# Altium schematic sheet 简化版原理图.SchDoc
size A3
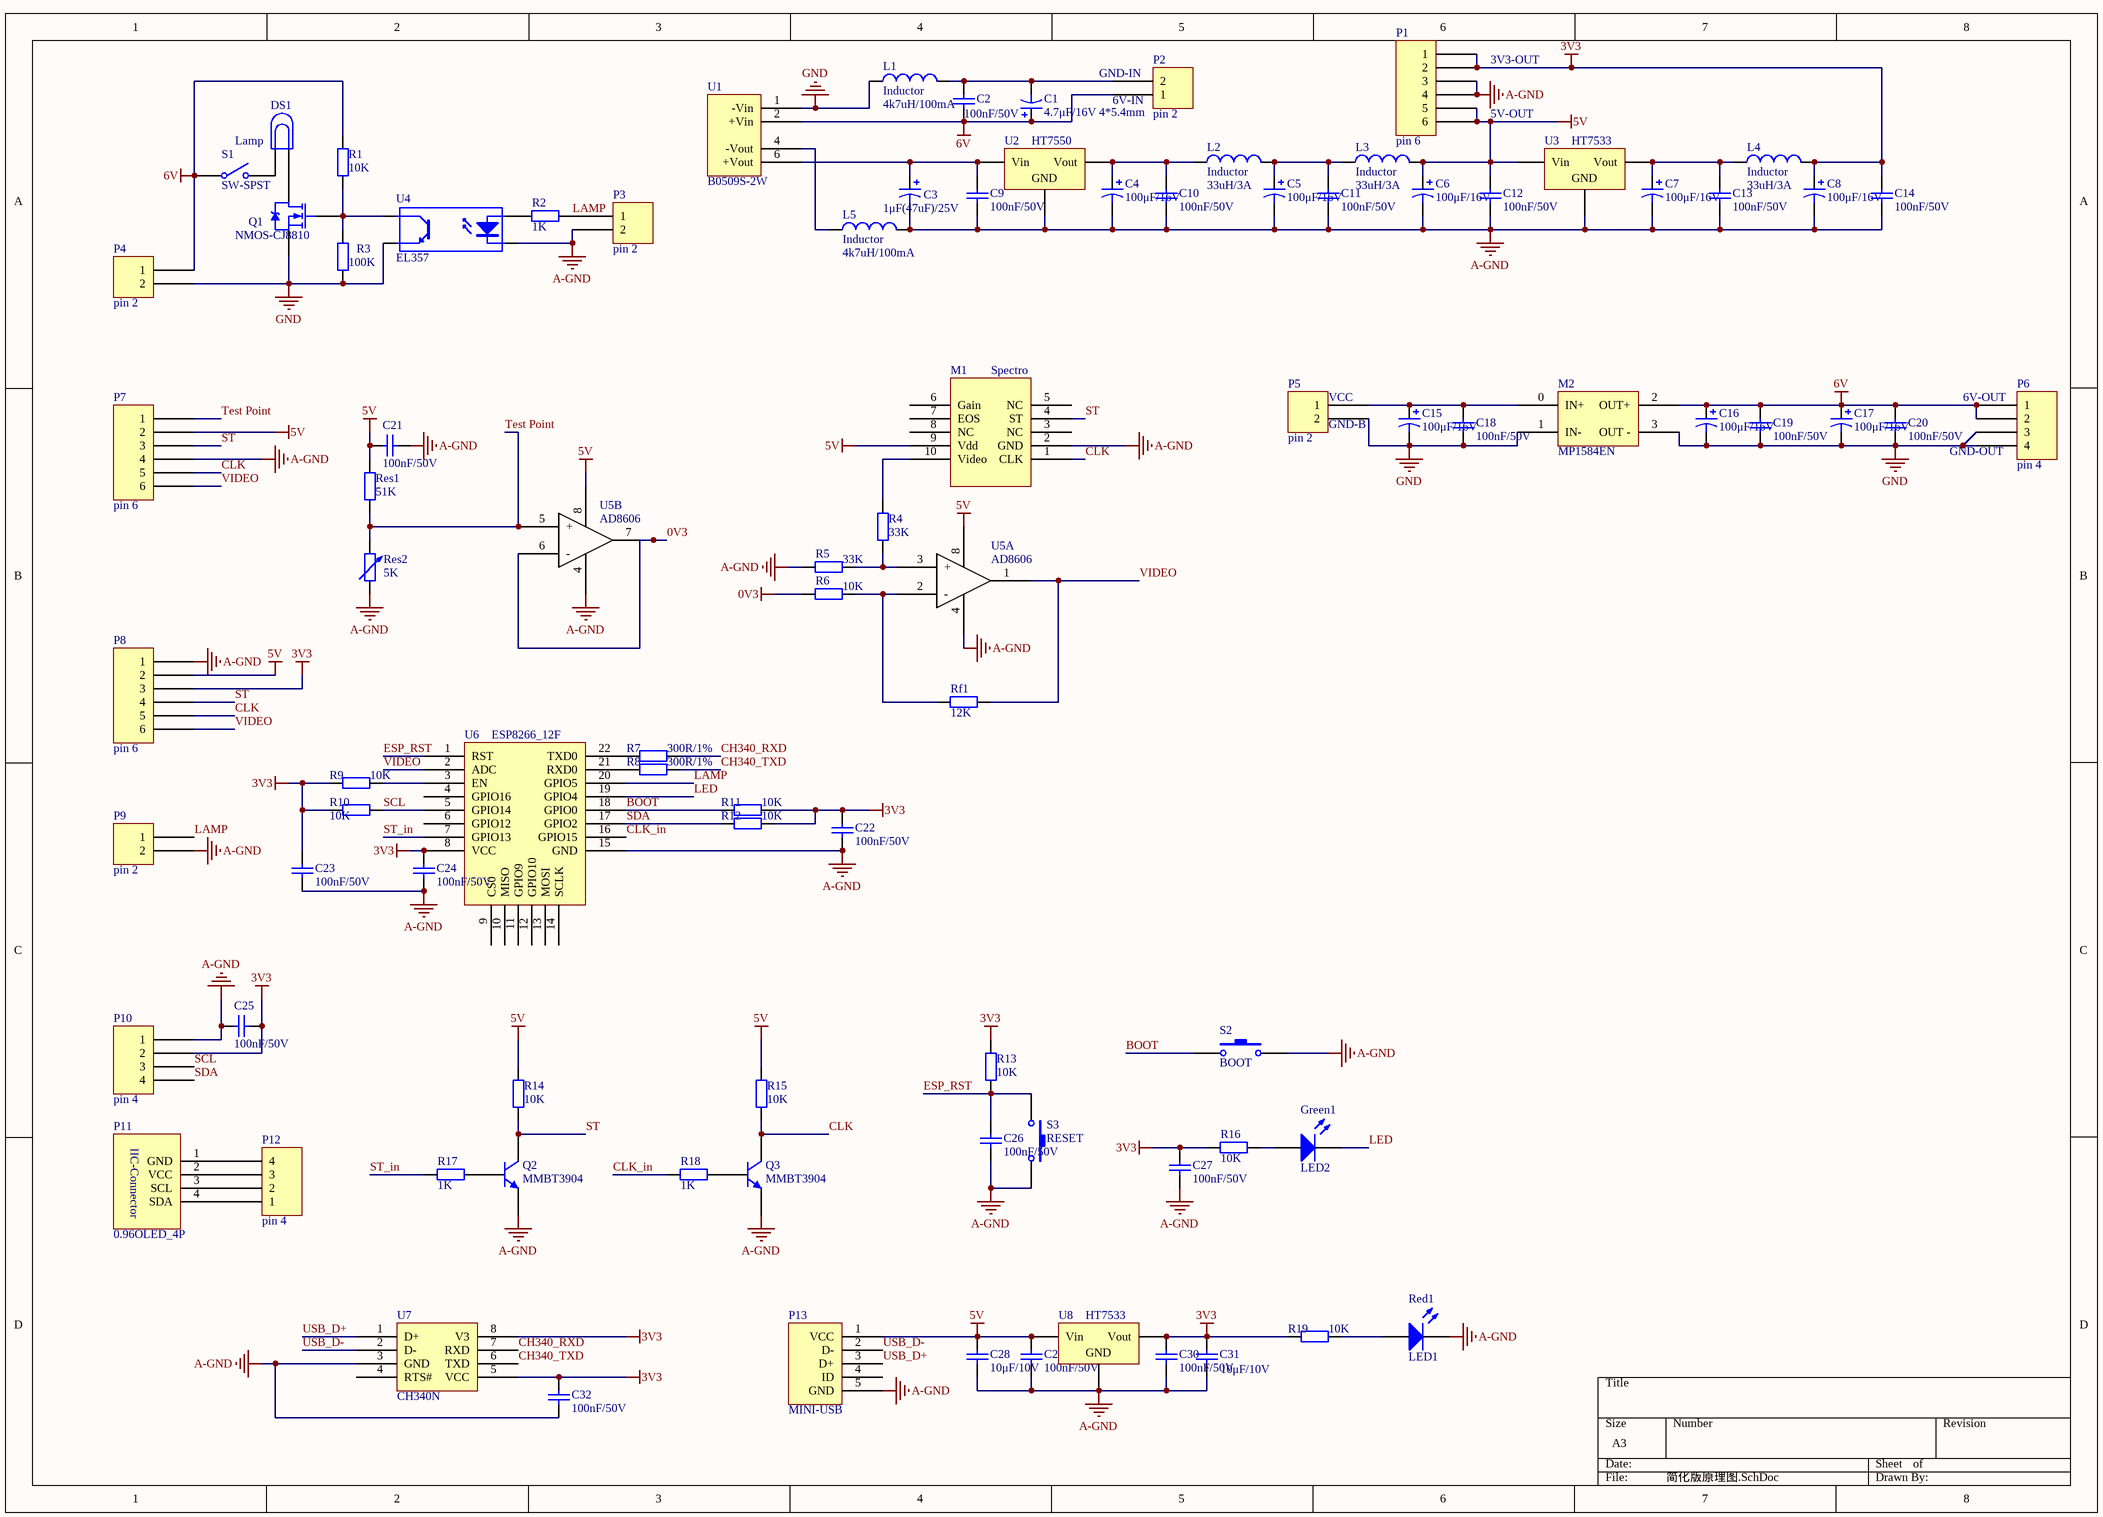
[diagram p0: 简化版原理图.SchDoc]

## Parts
C1  4.7μF/16V 4*5.4mm  [CAP4x5.4-SMD]
C2  100nF/50V  [0603]
C3  1μF(47uF)/25V  [CAP6.3x5.4-SMD]
C4  100μF/16V  [CAP6.3x5.4-SMD]
C5  100μF/16V  [CAP6.3x5.4-SMD]
C6  100μF/16V  [CAP6.3x5.4-SMD]
C7  100μF/16V  [CAP6.3x5.4-SMD]
C8  100μF/16V  [CAP6.3x5.4-SMD]
C9  100nF/50V  [0603]
C10  100nF/50V  [0603]
C11  100nF/50V  [0603]
C12  100nF/50V  [0603]
C13  100nF/50V  [0603]
C14  100nF/50V  [0603]
C15  100μF/16V  [CAP6.3x5.4-SMD]
C16  100μF/16V  [CAP6.3x5.4-SMD]
C17  100μF/16V  [CAP6.3x5.4-SMD]
C18  100nF/50V  [0603]
C19  100nF/50V  [0603]
C20  100nF/50V  [0603]
C21  100nF/50V  [0603]
C22  100nF/50V  [0603]
C23  100nF/50V  [0603]
C24  100nF/50V  [0603]
C25  100nF/50V  [0603]
C26  100nF/50V  [0603]
C27  100nF/50V  [0603]
C28  10μF/10V  [0805]
C29  100nF/50V  [0603]
C30  100nF/50V  [0603]
C31  10μF/10V  [0805]
C32  100nF/50V  [0603]
DS1  Lamp  [LAMP]
Green1  LED2  [0805-LED]
L1  Inductor  value 4k7uH/100mA  [L 0810]
L2  Inductor  value 33uH/3A  [0650]
L3  Inductor  value 33uH/3A  [0650]
L4  Inductor  value 33uH/3A  [0650]
L5  Inductor  value 4k7uH/100mA  [L 0810]
M1  Spectro  [c10988ma]
M2  MP1584EN  [MP1584EN模块]
P1  pin 6  [PIN-6-2.54-1.0]
P2  pin 2  [PIN-2-2.54-1.0]
P3  pin 2  [PIN-2-2.54-1.0]
P4  pin 2  [PIN-2-2.54-1.0]
P5  pin 2  [PIN-2-2.54-1.0]
P6  pin 4  [PIN-4-2.54-1.0]
P7  pin 6  [PIN-6-2.54-1.0]
P8  pin 6  [PIN-6-2.54-1.0]
P9  pin 2  [PIN-2-2.54-1.0]
P10  pin 4  [PIN-4-2.54-1.0]
P11  0.96OLED_4P  [OLED0.96-4P]
P12  pin 4  [PIN-4-2.54-1.0]
P13  MINI-USB  [Micro_USB全贴片]
Q1  NMOS-CJ8810  [SOT-23]
Q2  MMBT3904  [SOT-23]
Q3  MMBT3904  [SOT-23]
R1  10K  [0603]
R2  1K  [0603]
R3  100K  [0603]
R4  33K  [0603]
R5  33K  [0603]
R6  10K  [0603]
R7  300R/1%  [0603]
R8  300R/1%  [0603]
R9  10K  [0603]
R10  10K  [0603]
R11  10K  [0603]
R12  10K  [0603]
R13  10K  [0603]
R14  10K  [0603]
R15  10K  [0603]
R16  10K  [0603]
R17  1K  [0603]
R18  1K  [0603]
R19  10K  [0603]
Red1  LED1  [0805-LED]
Res1  51K  [0603]
Res2  5K  [RES-ADJ]
Rf1  12K  [0603]
S1  SW-SPST  [swich-big]
S2  BOOT  [Swich-mini]
S3  RESET  [Swich-mini]
U1  B0509S-2W  [B0509S-2W]
U2  HT7550  [SOT-89]
U3  HT7533  [SOT-89]
U4  EL357  [SOP4-bigger]
U5  AD8606  [SOP8]  (parts A,B of 2)
U6  ESP8266_12F  [esp8266-12f]
U7  CH340N  [SOP8]
U8  HT7533  [SOT-89]

## Nets
0V3: R6.1 U5.6(-) U5.7(OUT)
3V3: C8.1 C14.2 C22.2 C23.2 C24.2 C25.1 C27.2 C30.2 C31.1 C32.2 L4.2 P1.1 P1.2 P8.3 P10.2 R9.1 R10.1 R11.2 R12.2 R13.2 R16.2 R19.1 U6.8(VCC) U7.5(VCC) U7.8(V3) U8.3(Vout)
5V: C6.1 C12.2 C21.2 C28.1 C29.2 L3.2 M1.9(Vdd) P1.5 P1.6 P7.2 P8.2 P13.1(VCC) R14.2 R15.2 Res1.2 U3.2(Vin) U5.8(VCC) U8.2(Vin)
6V: C1.1 C2.1 C16.1 C17.1 C19.2 C20.2 M2.2(OUT+) P2.1 P4.1 P6.1 P6.2 R1.2 S1.1(COMMON) U1.2(+Vin)
A-GND: C3.2 C4.2 C5.2 C6.2 C7.2 C8.2 C9.1 C10.1 C11.1 C12.1 C13.1 C14.1 C21.1 C22.1 C23.1 C24.1 C25.2 C26.1 C27.1 C28.2 C29.1 C30.1 C31.2 C32.1 L5.2 M1.2(GND) P1.3 P1.4 P3.2 P7.4 P8.1 P9.2 P10.1 P13.5(GND) Q2.2(E) Q3.2(E) R5.1 Red1.2(K) Res2.1 S2.2 S3.2 U2.1(GND) U3.1(GND) U4.2(K) U5.4(VEE) U6.15(GND) U7.3(GND) U8.1(GND)
GND: C15.2 C16.2 C17.2 C18.1 C19.1 C20.1 L1.1 M2.1(IN-) M2.3(OUT_-) P4.2 P5.2 P6.3 P6.4 Q1.2(S) R3.1 U1.1(-Vin) U4.3(E)
BOOT: R11.1 S2.1 U6.18(GPIO0)
CH340_RXD: R7.2 U7.7(RXD)
CH340_TXD: R8.2 U7.6(TXD)
CLK: M1.1(CLK) P7.5 P8.5 Q3.3(C) R15.1
CLK_in: R18.2 U6.16(GPIO15)
ESP_RST: C26.2 R13.1 S3.1 U6.1(RST)
LAMP: P3.1 P9.1 R2.2 U6.20(GPIO5)
LED: Green1.2(K) U6.19(GPIO4)
SCL: P10.3 R10.2 U6.5(GPIO14)
SDA: P10.4 R12.1 U6.17(GPIO2)
ST: M1.4(ST) P7.3 P8.4 Q2.3(C) R14.1
ST_in: R17.2 U6.7(GPIO13)
Test Point: P7.1 Res1.1 Res2.2 U5.5(+)
USB_D+: P13.3(D+) U7.1(D+)
USB_D-: P13.2(D-) U7.2(D-)
VIDEO: P7.6 P8.6 Rf1.2 U5.1(OUT) U6.2(ADC)
NetC1_2: C1.2 C2.2 L1.2 P2.2
NetC3_1: C3.1 C9.2 U1.6(+Vout) U2.2(Vin)
NetC4_1: C4.1 C10.2 L2.1 U2.3(Vout)
NetC5_1: C5.1 C11.2 L2.2 L3.1
NetC7_1: C7.1 C13.2 L4.1 U3.3(Vout)
NetC15_1: C15.1 C18.2 M2.0(IN+) P5.1
NetDS1_1: DS1.1 S1.2(NO)
NetDS1_2: DS1.2 Q1.3(D)
NetGreen1_1: Green1.1(A) R16.1
NetL5_1: L5.1 U1.4(-Vout)
NetM1_10: M1.10(Video) R4.2
NetP11_1: P11.1(GND) P12.4
NetP11_2: P11.2(VCC) P12.3
NetP11_3: P11.3(SCL) P12.2
NetP11_4: P11.4(SDA) P12.1
NetQ1_1: Q1.1(G) R1.1 R3.2 U4.4(C)
NetQ2_1: Q2.1(B) R17.1
NetQ3_1: Q3.1(B) R18.1
NetR2_1: R2.1 U4.1(A)
NetR4_1: R4.1 R5.2 U5.3(+)
NetR6_2: R6.2 Rf1.1 U5.2(-)
NetR7_1: R7.1 U6.22(TXD0)
NetR8_1: R8.1 U6.21(RXD0)
NetR9_2: R9.2 U6.3(EN)
NetR19_2: R19.2 Red1.1(A)

Not connected (* = marked no-connect by the designer): M1 3(NC) 5(NC) 6(Gain) 7(EOS) 8(NC); P13 4(ID); U6 4(GPIO16) 6(GPIO12) 9(CS0) 10(MISO) 11(GPIO9) 12(GPIO10) 13(MOSI) 14(SCLK); U7 4(RTS#)

## Notes on the sheet
- (near P2) GND-IN
- (near P2) 6V-IN
- 3V3-OUT
- 5V-OUT
- (near P5) VCC
- (near P5) GND-B
- (near P6) GND-OUT
- (near P6) 6V-OUT
- (in symbol 0.96OLED_4P) IIC-Connector

## Library data of the parts
C1 C3-C8 C15-C17 = Cap Pol1: Polarized Capacitor (Radial); Value: 100μF; Published: 8-Jun-2000; LatestRevisionDate: 17-Jul-2002; LatestRevisionNote: Re-released for DXP Platform.; PackageReference: RB7.6-15; Publisher: Altium Limited; PackageDescription: Polarized Capacitor (Radial); 2 Leads
C2 C9-C14 C18-C32 = Cap: Capacitor; Value: 0.1μF; Published: 8-Jun-2000; LatestRevisionDate: 17-Jul-2002; LatestRevisionNote: Re-released for DXP Platform.; PackageReference: RAD-0.3; Publisher: Altium Limited; PackageDescription: Radial Cap, Thru-Hole; 2 Leads; 0.3 in Pin Spacing
DS1 = Lamp: Incandescent Bulb; Published: 24-Mar-1999; LatestRevisionNote: Re-released for DXP Platform.; PackageReference: PIN2; Publisher: Altium Limited
Green1 Red1 = LED1: Typical RED GaAs LED; Published: 8-Jun-2000; LatestRevisionDate: 08-Jul-2005; LatestRevisionNote: Mech Layer 1 removed.; PackageReference: LED-1; Publisher: Altium Limited; PackageDescription: LED; 2 Leads
L1-L5 = Inductor: Code_IEC: 1005; Published: 8-Jun-2000; LatestRevisionDate: 29-May-2009; LatestRevisionNote: IPC-7351 Footprint Added.; PackageReference: 0402-A; Publisher: Altium Limited; PackageDescription: Chip Inductor; Code_JEITA: 0402
M2 = MP1584EN模块
P13 = MINI-USB_JX
Q1 = NMOS-2: N-Channel Power MOSFET; Note: Pin 2 is electrically connected to pin 4.; Published: 8-Jun-2000; LatestRevisionDate: 17-Jul-2002; LatestRevisionNote: Re-released for DXP Platform.; DatasheetVersion: PD-9.814; PackageVersion: Feb-1997; PackageReference: TO-220AB; Publisher: Altium Limited; PackageDescription: TO, Thru-Hole, Vertical, Heatsink Mounted; 3 In-Line Leads; Pitch 2.54 mm; ComponentLink1Description: Manufacturer Link; ComponentLink1URL: http://www.irf.com/
Q2 Q3 = 2N3904: NPN General Purpose Amplifier; Published: 8-Jun-2000; LatestRevisionDate: 15-Jan-2003; LatestRevisionNote: PCB Footprint 'BCY-W3/D4.7' replaced; DatasheetVersion: 1997; PackageVersion: Sep-1998; PackageReference: TO-92A; Publisher: Altium Limited; PackageDescription: TO, Flat Index; 3 In-Line, Axial Leads; Body Dia. 4.5mm; Leads 0.51 x 0.48 mm (max); ComponentLink1Description: Manufacturer Link; ComponentLink1URL: http://www.fairchildsemi.com/; ComponentLink2Description: Datasheet; ComponentLink2URL: http://www.fairchildsemi.com/ds/2N%2F2N3904.pdf
R1 R2 = Res2: Resistor; Value: 100K; Published: 8-Jun-2000; LatestRevisionDate: 17-Jul-2002; LatestRevisionNote: Re-released for DXP Platform.; PackageReference: AXIAL-0.4; Publisher: Altium Limited; PackageDescription: Axial Device, Thru-Hole; 2 Leads; 0.4 in Pin Spacing
R3-R6 R9-R16 R19 Res1 = Res2: Resistor; Published: 8-Jun-2000; LatestRevisionDate: 17-Jul-2002; LatestRevisionNote: Re-released for DXP Platform.; PackageReference: AXIAL-0.4; Publisher: Altium Limited; PackageDescription: Axial Device, Thru-Hole; 2 Leads; 0.4 in Pin Spacing
  R3: Value: 100K
  R4 R5: Value: 33K
  R6 R9-R16 R19: Value: 10K
  Res1: Value: 51K
R7 R8 R17 R18 = Res2: Resistor; Value: 10K; Published: 8-Jun-2000; LatestRevisionDate: 17-Jul-2002; LatestRevisionNote: Re-released for DXP Platform.; PackageReference: AXIAL-0.4; Publisher: Altium Limited; PackageDescription: Axial Device, Thru-Hole; 2 Leads; 0.4 in Pin Spacing
Res2 = Res Adj2: Variable Resistor; Value: 3.3K; Set Position: 0.5; Published: 8-Jun-2000; LatestRevisionDate: 17-Jul-2002; LatestRevisionNote: Re-released for DXP Platform.; PackageReference: AXIAL-0.6; Publisher: Altium Limited; PackageDescription: Axial Device, Thru-Hole; 2 Leads; 0.6 in Pin Spacing
Rf1 = Res2: Resistor; Value: 33K; Published: 8-Jun-2000; LatestRevisionDate: 17-Jul-2002; LatestRevisionNote: Re-released for DXP Platform.; PackageReference: AXIAL-0.4; Publisher: Altium Limited; PackageDescription: Axial Device, Thru-Hole; 2 Leads; 0.4 in Pin Spacing
S1 = SW-SPST: Single-Pole, Single-Throw Switch; Published: 24-Mar-1999; LatestRevisionDate: 17-Jul-2002; LatestRevisionNote: Re-released for DXP Platform.; PackageReference: SPST-2; Publisher: Altium Limited; PackageDescription: Switch; 2 Leads
S2 S3 = SW-PB: Switch; Published: 24-Mar-1999; LatestRevisionDate: 17-Jul-2002; LatestRevisionNote: Re-released for DXP Platform.; PackageReference: SPST-2; Publisher: Altium Limited; PackageDescription: Switch; 2 Leads
U2 U3 U8 = Volt Reg: Voltage Regulator; Published: 24-Mar-1999; LatestRevisionDate: 29-May-2009; LatestRevisionNote: IPC-7351 Footprint Added.; PackageReference: D2PAK; Publisher: Altium Limited; PackageDescription: 3-Pin Transistor Outline Package 2.54 mm Pitch, 15.1 mm Lead Span
U4 = Optoisolator1: 4-Pin Phototransistor Optocoupler; Published: 24-Mar-1999; LatestRevisionDate: 04-Mar-2005; LatestRevisionNote: Sch pins 3 & 4 Swapped.; DatasheetVersion: Nov-2003; PackageReference: DIP-4; Publisher: Altium Limited
U5 = LM358